# Altium schematic sheet Processor_power.SchDoc
size 420 x 297 mm; CmpIndex: 82; SymIndex: 30
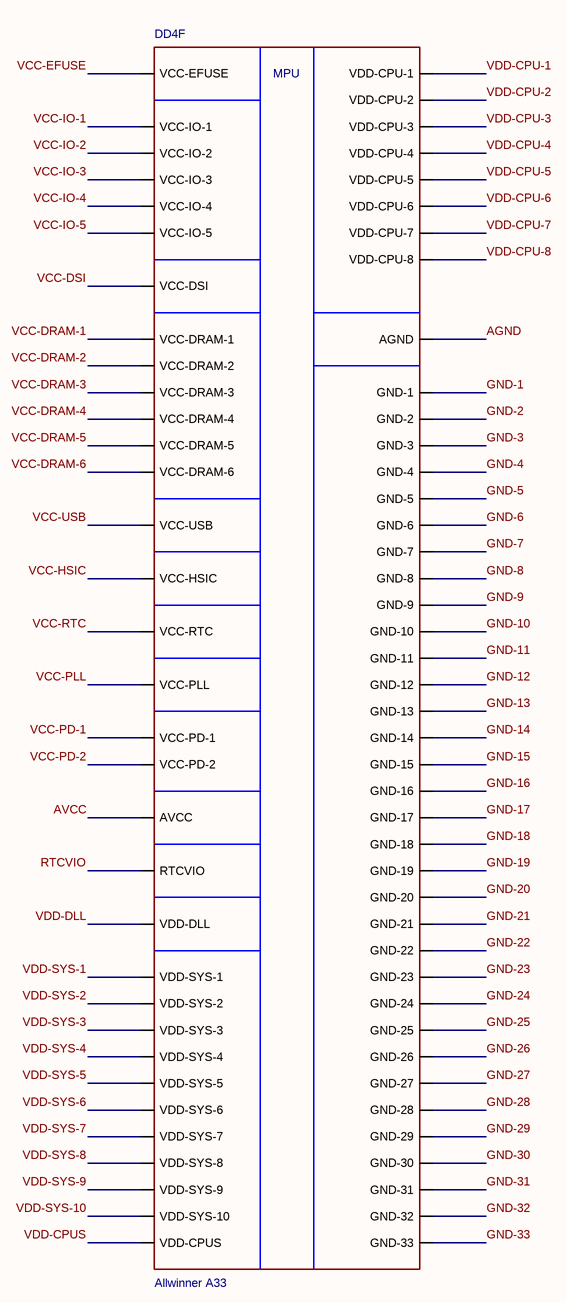
[diagram p0: Processor_power.SchDoc]

## Parts
DD4  Allwinner A33  (part F of 7)

## Nets
AGND: DD4.H13(AGND)
AVCC: DD4.L16(AVCC)
GND-1: DD4.N4(GND-1)
GND-2: DD4.F8(GND-2)
GND-3: DD4.F9(GND-3)
GND-4: DD4.F10(GND-4)
GND-5: DD4.G7(GND-5)
GND-6: DD4.G8(GND-6)
GND-7: DD4.G9(GND-7)
GND-8: DD4.G10(GND-8)
GND-9: DD4.G11(GND-9)
GND-10: DD4.H7(GND-10)
GND-11: DD4.H8(GND-11)
GND-12: DD4.H9(GND-12)
GND-13: DD4.H10(GND-13)
GND-14: DD4.H11(GND-14)
GND-15: DD4.H12(GND-15)
GND-16: DD4.J7(GND-16)
GND-17: DD4.J8(GND-17)
GND-18: DD4.J9(GND-18)
GND-19: DD4.J10(GND-19)
GND-20: DD4.J11(GND-20)
GND-21: DD4.J12(GND-21)
GND-22: DD4.K7(GND-22)
GND-23: DD4.K8(GND-23)
GND-24: DD4.K9(GND-24)
GND-25: DD4.K10(GND-25)
GND-26: DD4.K11(GND-26)
GND-27: DD4.K12(GND-27)
GND-28: DD4.L8(GND-28)
GND-29: DD4.L9(GND-29)
GND-30: DD4.L10(GND-30)
GND-31: DD4.L11(GND-31)
GND-32: DD4.M9(GND-32)
GND-33: DD4.M10(GND-33)
RTCVIO: DD4.M13(RTCVIO)
VCC-DRAM-1: DD4.H5(VCC-DRAM-1)
VCC-DRAM-2: DD4.J5(VCC-DRAM-2)
VCC-DRAM-3: DD4.K5(VCC-DRAM-3)
VCC-DRAM-4: DD4.L5(VCC-DRAM-4)
VCC-DRAM-5: DD4.H6(VCC-DRAM-5)
VCC-DRAM-6: DD4.J6(VCC-DRAM-6)
VCC-DSI: DD4.N6(VCC-DSI)
VCC-EFUSE: DD4.M8(VCC-EFUSE)
VCC-HSIC: DD4.N12(VCC-HSIC)
VCC-IO-1: DD4.E11(VCC-IO-1)
VCC-IO-2: DD4.E12(VCC-IO-2)
VCC-IO-3: DD4.F11(VCC-IO-3)
VCC-IO-4: DD4.F12(VCC-IO-4)
VCC-IO-5: DD4.G12(VCC-IO-5)
VCC-PD-1: DD4.M11(VCC-PD-1)
VCC-PD-2: DD4.N11(VCC-PD-2)
VCC-PLL: DD4.M5(VCC-PLL)
VCC-RTC: DD4.M12(VCC-RTC)
VCC-USB: DD4.L12(VCC-USB)
VDD-CPU-1: DD4.E5(VDD-CPU-1)
VDD-CPU-2: DD4.E6(VDD-CPU-2)
VDD-CPU-3: DD4.E7(VDD-CPU-3)
VDD-CPU-4: DD4.F5(VDD-CPU-4)
VDD-CPU-5: DD4.F6(VDD-CPU-5)
VDD-CPU-6: DD4.F7(VDD-CPU-6)
VDD-CPU-7: DD4.G5(VDD-CPU-7)
VDD-CPU-8: DD4.G6(VDD-CPU-8)
VDD-CPUS: DD4.M14(VDD-CPUS)
VDD-DLL: DD4.P3(VDD-DLL)
VDD-SYS-1: DD4.E8(VDD-SYS-1)
VDD-SYS-2: DD4.E9(VDD-SYS-2)
VDD-SYS-3: DD4.E10(VDD-SYS-3)
VDD-SYS-4: DD4.K6(VDD-SYS-4)
VDD-SYS-5: DD4.L6(VDD-SYS-5)
VDD-SYS-6: DD4.M6(VDD-SYS-6)
VDD-SYS-7: DD4.M7(VDD-SYS-7)
VDD-SYS-8: DD4.N8(VDD-SYS-8)
VDD-SYS-9: DD4.N9(VDD-SYS-9)
VDD-SYS-10: DD4.N10(VDD-SYS-10)

## Notes on the sheet
- Лист
- Изм.
- № Докум.
- Подп.
- Дата
- (in symbol Allwinner A33, part F) MPU

## Library data of the parts
DD4 = Allwinner A33: CmpIndex: 79; DXDB_LIBNAME: Embedded Microprocessors; Ref Designator: DD4; SymIndex: 32; Orientation: 0 = 0; Part Label: Allwinner A33; Part Name: Allwinner A33; Part Number NP: Allwinner A33; Part Number: Allwinner A33